# Altium schematic sheet Block Diagram.SchDoc: Mixed Signal Board Design
size A4; Author: Nilay Nandimath; DrawnBy: Nilay Nandimath; Engineer: Nilay Nandimath; Organization: -; Address1: -; Address2: -; Address3: -; Address4: -; DocumentNumber: 1; Revision: 1; SheetNumber: 1; SheetTotal: 11; Title2: -; Project: -; ENG_APP_DATE: -; DSN_APP_DATE: -; CHK_APP_DATE: -; ImagePath: -; Application_BuildNumber: -
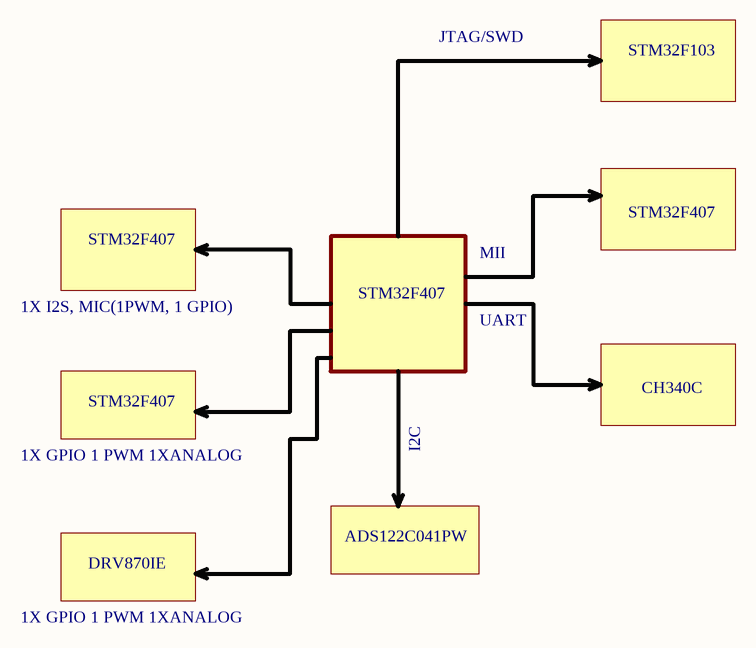
[diagram p0: Block Diagram.SchDoc]

## Notes on the sheet
- JTAG/SWD
- STM32F103
- STM32F407
- MII
- 1X I2S, MIC(1PWM, 1 GPIO)
- UART
- CH340C
- 1X GPIO 1 PWM 1XANALOG
- I2C
- DRV870IE
- ADS122C041PW
- DWG. NO.
- REV.
- SHT.
- THIS DOCUMENT AND THE DATA DISCLOSED HEREIN OR HEREWITH IS THE PROPERTY OF ALTIUM LIMITED AND MAY BE FREELY DISTRIBUTED IN WHOLE. NO RIGHTS ARE RESERVED OR EXPRESS OR IMPLIED WARANTEE GIVEN.
- REVISION
- DESCRIPTION
- DATE
- APPROVED
- ENG:
- APPROVALS
- PROJECT
- DSN:
- CHK:
- REFERENCE DOCUMENTS
- PROJECT REVISION:
- TITLE
- DOCUMENT REVISION:
- DESIGN ITEM:
- BOM:
- FAB DWG:
- PCB DWG:
- ASSY DWG:
- SCALE:
- SIZE
- B
- CAGE CODE
- FILE NAME
- DWG NO.
- SHEET
- OF
- REV